# EAGLE design Keg Cop - RJ45 (EAGLE 9.5.2)
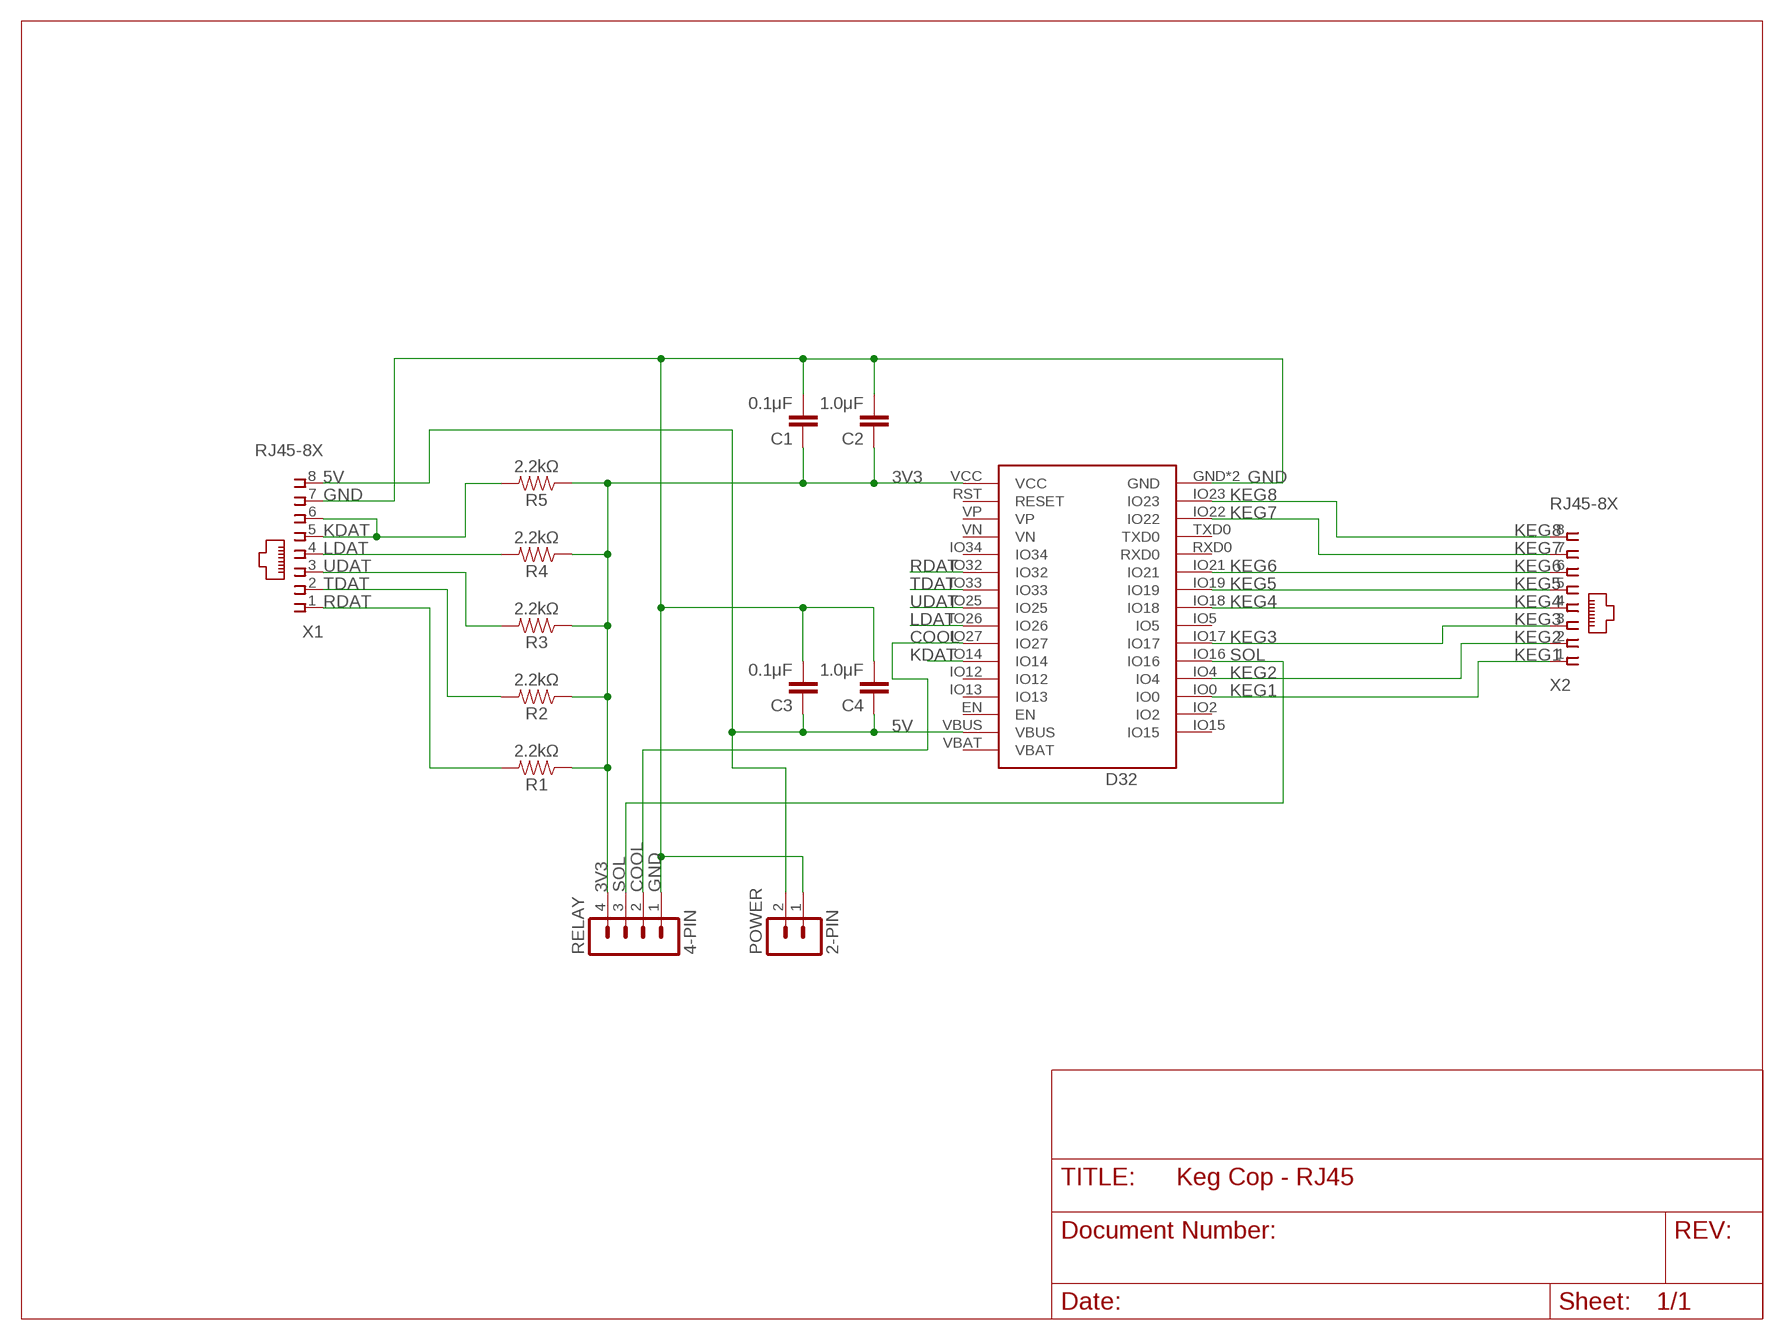
[diagram p0: schematic, sheet 1]

## Parts
C1  0.1μF  CAP_CERAMIC_2.54  [CAP_PTH-2.54]
C2  1.0μF  CAP_CERAMIC_2.54  [CAP_PTH-2.54]
C3  0.1μF  CAP_CERAMIC_2.54  [CAP_PTH-2.54]
C4  1.0μF  CAP_CERAMIC_2.54  [CAP_PTH-2.54]
D32  Lolin D32  WEMOS-D32D32_NO_BATT  [D32_NO_BATT]
POWER  2-PIN  HDR-2  [HDR-2_VERT]
R1  2.2kΩ  RESISTORAXIAL-0.3  [AXIAL-0.3]
R2  2.2kΩ  RESISTORAXIAL-0.3  [AXIAL-0.3]
R3  2.2kΩ  RESISTORAXIAL-0.3  [AXIAL-0.3]
R4  2.2kΩ  RESISTORAXIAL-0.3  [AXIAL-0.3]
R5  2.2kΩ  RESISTORAXIAL-0.3  [AXIAL-0.3]
RELAY  4-PIN  MA04-1  [MA04-1]
X1  RJ45-8X  [RJ45-NO-SHIELD]
X2  RJ45-8X  [RJ45-NO-SHIELD]

## Nets
3V3 [3v]: C1.1 C2.1 D32.VCC R1.P$1 R2.P$1 R3.P$1 R4.P$1 R5.P$1 RELAY.4
5V [5v]: C3.1 C4.1 D32.VBUS POWER.2 X1.8
COOL: D32.IO27 RELAY.2
GND: C1.2 C2.2 C3.2 C4.2 D32.GND D32.GND2(GND) POWER.1 RELAY.1 X1.7
KDAT: D32.IO14 R5.P$2 X1.5 X1.6
KEG1: D32.IO0 X2.1
KEG2: D32.IO4 X2.2
KEG3: D32.IO17 X2.3
KEG4: D32.IO18 X2.4
KEG5: D32.IO19 X2.5
KEG6: D32.IO21 X2.6
KEG7: D32.IO22 X2.7
KEG8: D32.IO23 X2.8
LDAT: D32.IO26 R4.P$2 X1.4
RDAT: D32.IO32 R1.P$2 X1.1
SOL: D32.IO16 RELAY.3
TDAT: D32.IO33 R2.P$2 X1.2
UDAT: D32.IO25 R3.P$2 X1.3
Unconnected: D32.EN D32.IO2 D32.IO5 D32.IO12 D32.IO13 D32.IO15 D32.IO34 D32.RST(RESET) D32.RXD0 D32.TXD0 D32.VBAT D32.VN D32.VP

## Library data of the parts
C1-C4 = Donnie:CAP_CERAMIC_2.54
D32 = Donnie:WEMOS-D32: D32_REVERSE is a Reverse silkscreen for placing the Wemos D32 on the underside of the board D32_NO-KEEPOUT removes the keepout area beneath the antenna on the D32 and provides a note to avoid components and traces.
POWER = Donnie:HDR-2
R1-R5 = SparkFun-Resistors:RESISTOR: Generic Resistor Package
RELAY = Donnie:MA04-1: PIN HEADER; OC_FARNELL: unknown; OC_NEWARK: unknown
X1 X2 = con-tycoelectronics:RJ45: CORCOM Modular RJ Jacks No Shield Source: www.tycoelectronics.com .. ENG_DS_1654001_1099_RJ_L_0507.pdf; MPN: RJ45-8X; OC_FARNELL: unknown; OC_NEWARK: 16R6101

## Net classes
0 default: width 0.305 mm, clearance 0.305 mm
1 5v: width 0.406 mm, clearance 0.406 mm
2 3v: width 0.406 mm, clearance 0.406 mm

## Board
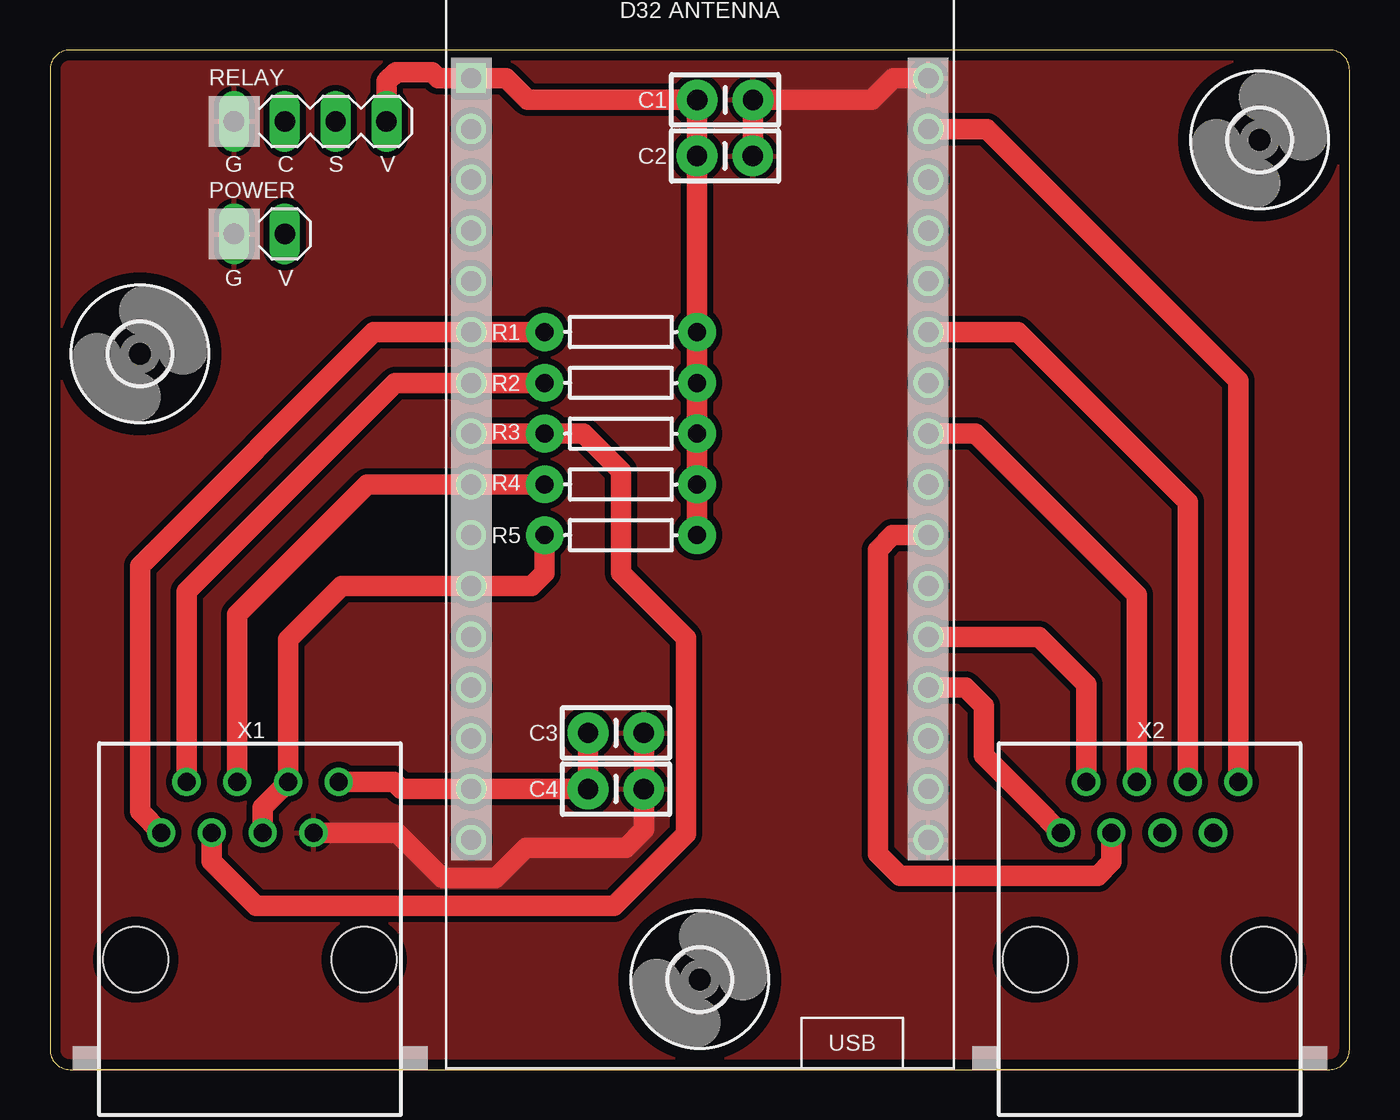
[diagram p1: board, top side]
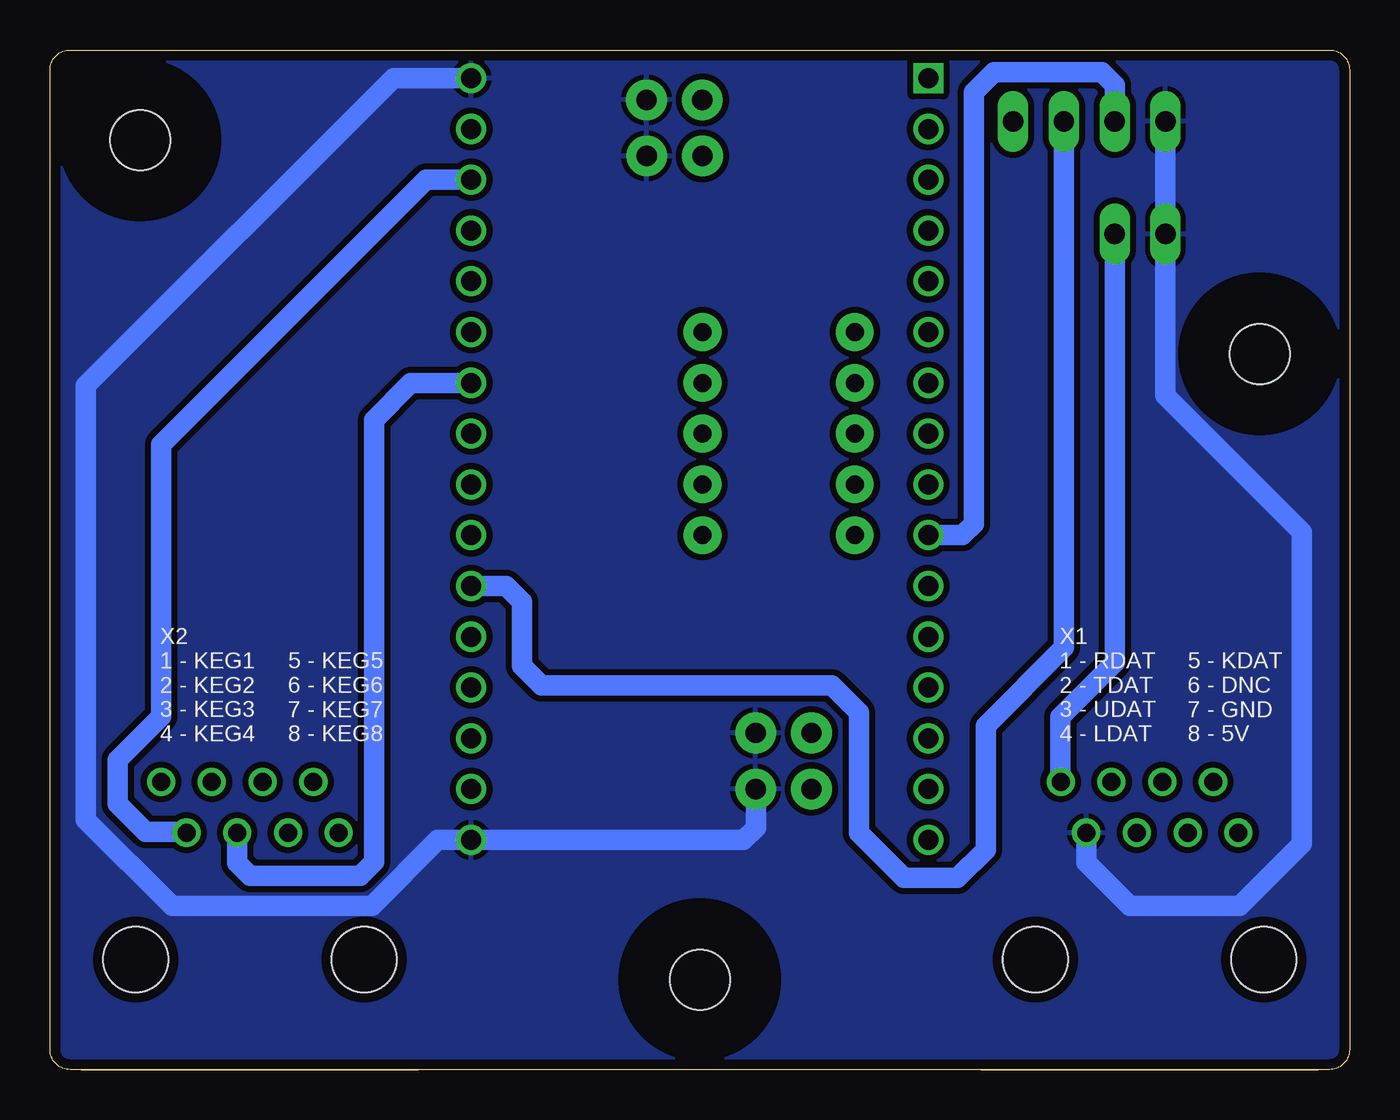
[diagram p2: board, bottom side, seen from below]

Size 65 x 51.01 mm. Coordinates in mm from the lower left corner, seen from the top.
Outline: 1,0.01 64,0.01 arc90 65,1.01 65,50.01 arc90 64,51.01 1,51.01 arc90 0,50.01 0,1.01 arc90 1,0.01
Copper layers (1*16): Top 0.035mm / dielectric 1.5mm / Bottom 0.035mm
Design rules "default *": minimum track width 6mil, minimum drill 0.35mm, track to track 6mil, track to pad 6mil, pad to pad 6mil, via to via 6mil, smd to smd 6mil, copper to edge 20mil, drill to drill 6mil, minimum pad ring 10mil, minimum via ring 8mil, stop-mask expansion 4mil, vias tented up to drill 20mil, thermal gap 10mil

### Footprints (pad centres in the part's own frame; a part is rotated, then mirrored left to right if it is on the bottom)
CAP_PTH-2.54 = drill 1.016 pad 2.032: 1 -1.397,0; 2 1.397,0
D32_NO_BATT = drill 1: EN -11.43,-12.7; GND 11.43,20.32; GND2 11.43,-17.78; IO0 11.43,-10.16; IO2 11.43,-12.7; IO4 11.43,-7.62; IO5 11.43,0; IO12 -11.43,-7.62; IO13 -11.43,-10.16; IO14 -11.43,-5.08; IO15 11.43,-15.24; IO16 11.43,-5.08; IO17 11.43,-2.54; IO18 11.43,2.54; IO19 11.43,5.08; IO21 11.43,7.62; IO22 11.43,15.24; IO23 11.43,17.78; IO25 -11.43,2.54; IO26 -11.43,0; IO27 -11.43,-2.54; IO32 -11.43,7.62; IO33 -11.43,5.08; IO34 -11.43,10.16; RST -11.43,17.78; RXD0 11.43,10.16; TXD0 11.43,12.7; VBAT -11.43,-17.78; VBUS -11.43,-15.24; VN -11.43,12.7; VP -11.43,15.24 | drill 1 square: VCC -11.43,20.32
HDR-2_VERT = drill 1.016 long: 1 0,0; 2 2.54,0
AXIAL-0.3 = drill 0.9 pad 1.88: P$1 -3.81,0; P$2 3.81,0
MA04-1 = drill 1.016 long: 1 -3.81,0; 2 -1.27,0; 3 1.27,0; 4 3.81,0
3,0 = hole 3: 0,0
RJ45-NO-SHIELD = drill 0.9 pad 1.4: 1 -4.445,6.35; 2 -3.175,8.89; 3 -1.905,6.35; 4 -0.635,8.89; 5 0.635,6.35; 6 1.905,8.89; 7 3.175,6.35; 8 4.445,8.89 | hole 3.251: -5.715,0; 5.715,0

### Placement (x,y rotation side)
C1  33.77,48.51 0 top
C2  33.76,45.71 0 top
C3  28.31,16.85 0 top
C4  28.31,14.04 0 top
D32  32.5,29.28 0 top
POWER  9.21,41.81 0 top
R1  28.55,36.9 180 top
R2  28.55,34.36 180 top
R3  28.55,31.82 180 top
R4  28.55,29.28 180 top
R5  28.55,26.74 180 top
RELAY  13.02,47.44 0 top
U$1  [3,0]  4.5,35.81 0 top
U$2  [3,0]  32.5,4.51 0 top
U$3  [3,0]  60.5,46.51 0 top
X1  10,5.51 0 top
X2  55,5.51 0 top

### Tracks (layer width: path | path; a pad name or v marks a point on that pad's centre or on a via)
3V3
  Top 1.016: R5.P$1 R4.P$1 R3.P$1 R2.P$1 R1.P$1 C2.1 C1.1 23.9,48.51 22.81,49.6 D32.VCC 19.41,49.6 19.1,49.91 17.3,49.91 16.83,49.44 RELAY.4
5V
  Top 1.016: X1.8 17.21,14.4 17.57,14.04 D32.VBUS C4.1 C3.1
  Bottom 1.016: X1.8 14.46,17.66 12.25,19.86 11.75,20.36 POWER.2
COOL
  Bottom 1.016: D32.IO27 19.37,26.74 18.8,27.31 18.8,43.11 18.8,48.91 17.8,49.91 12.4,49.91 11.75,49.26 RELAY.2
GND
  Top 1.016: C2.2 C1.2 41.1,48.51 42.19,49.6 D32.GND | X1.7 17.35,11.86 19.6,9.61 22.3,9.61 23.8,11.11 28.8,11.11 29.71,12.02 C4.2 C3.2
  Bottom 0.406: C4.2
  Bottom 1.016: X1.7 13.18,10.39 11,8.21 5.49,8.21 2.4,11.3 2.4,26.51 2.4,26.91 9.21,33.72 POWER.1 RELAY.1 | D32.GND 47.81,49.6 63.2,34.21 63.2,12.51 58.9,8.21 48.9,8.21 45.61,11.5 D32.GND2 30.31,11.5 29.7,12.11 C4.2
  pour Top: 65.4,51.21 65.4,-0.09 -0.2,-0.09 -0.2,51.21
  pour Bottom: -0.2,51.31 -0.2,-0.29 65.2,-0.29 65.2,51.31
KDAT
  Top 1.016: X1.5 10.63,13.13 X1.6 11.9,21.52 14.59,24.2 D32.IO14 24.09,24.2 24.74,24.85 R5.P$2
KEG1
  Top 1.016: X2.1 49.2,13.22 46.7,15.72 46.7,18.21 45.79,19.12 D32.IO0
KEG2
  Top 1.016: X2.2 51.83,19.29 49.45,21.66 D32.IO4
KEG3
  Top 1.016: D32.IO17 42.13,26.74 41.4,26.01 41.4,10.81 42.5,9.71 52.4,9.71 53.09,10.41 X2.3
KEG4
  Top 1.016: D32.IO18 46.29,31.82 54.37,23.75 X2.4
KEG5
  Bottom 1.016: D32.IO19 46.95,34.36 48.8,32.51 48.8,10.41 49.5,9.71 55,9.71 55.63,10.35 X2.5
KEG6
  Top 1.016: D32.IO21 48.41,36.9 56.91,28.41 X2.6
KEG7
  Bottom 1.016: X2.7 58.42,11.91 60.2,11.91 61.6,13.31 61.6,15.51 59.44,17.68 59.44,31.28 46.19,44.52 D32.IO22
KEG8
  Top 1.016: D32.IO23 46.85,47.06 59.45,34.47 X2.8
LDAT
  Top 1.016: X1.4 9.37,22.78 15.87,29.28 20.9,29.28 | 20.9,29.28 D32.IO26 | R4.P$2 20.9,29.28
RDAT
  Top 1.016: X1.1 4.5,12.92 4.5,25.21 16.19,36.9 D32.IO32 21.18,36.9 R1.P$2
SOL
  Bottom 1.016: RELAY.3 14.29,21.12 18.2,17.21 18.2,11.01 19.61,9.61 22.3,9.61 24.54,11.85 24.54,17.88 25.88,19.22 40.41,19.22 41.4,20.21 41.4,23.41 42.19,24.2 D32.IO16
TDAT
  Top 1.016: X1.2 6.83,23.94 17.25,34.36 D32.IO33 21.18,34.36 R2.P$2
UDAT
  Top 1.016: X1.3 8.1,10.42 10.3,8.21 28.2,8.21 31.8,11.81 31.8,21.61 28.56,24.85 28.56,29.95 26.69,31.82 R3.P$2 21.18,31.82 D32.IO25

### Text on the board
tNames: G | C | S | V | G | V
bNames: 5 - KDAT / 6 - DNC / 7 - GND / 8 - 5V | X1 / 1 - RDAT / 2 - TDAT / 3 - UDAT / 4 - LDAT | 5 - KEG5 / 6 - KEG6 / 7 - KEG7 / 8 - KEG8 | X2 / 1 - KEG1 / 2 - KEG2 / 3 - KEG3 / 4 - KEG4